# EAGLE design Gateway v1 (EAGLE 9.5.0)
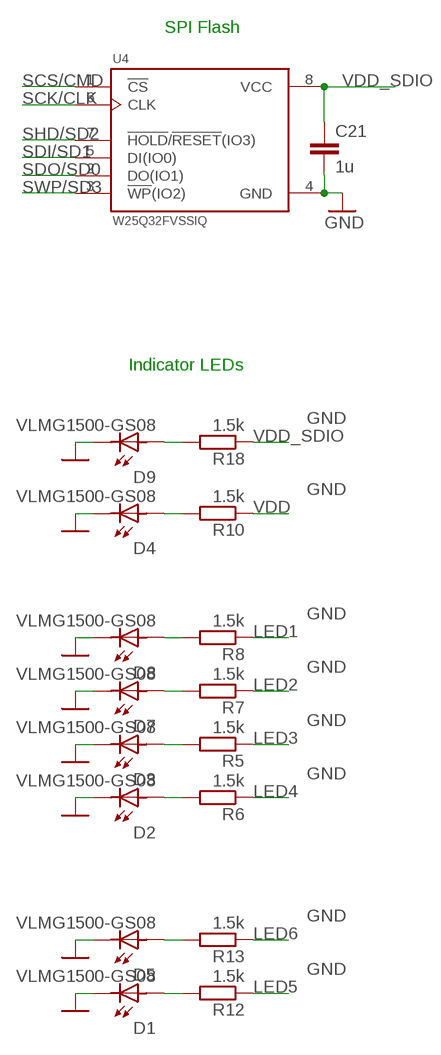
[diagram p0: schematic, sheet 1, part 1 of 2]
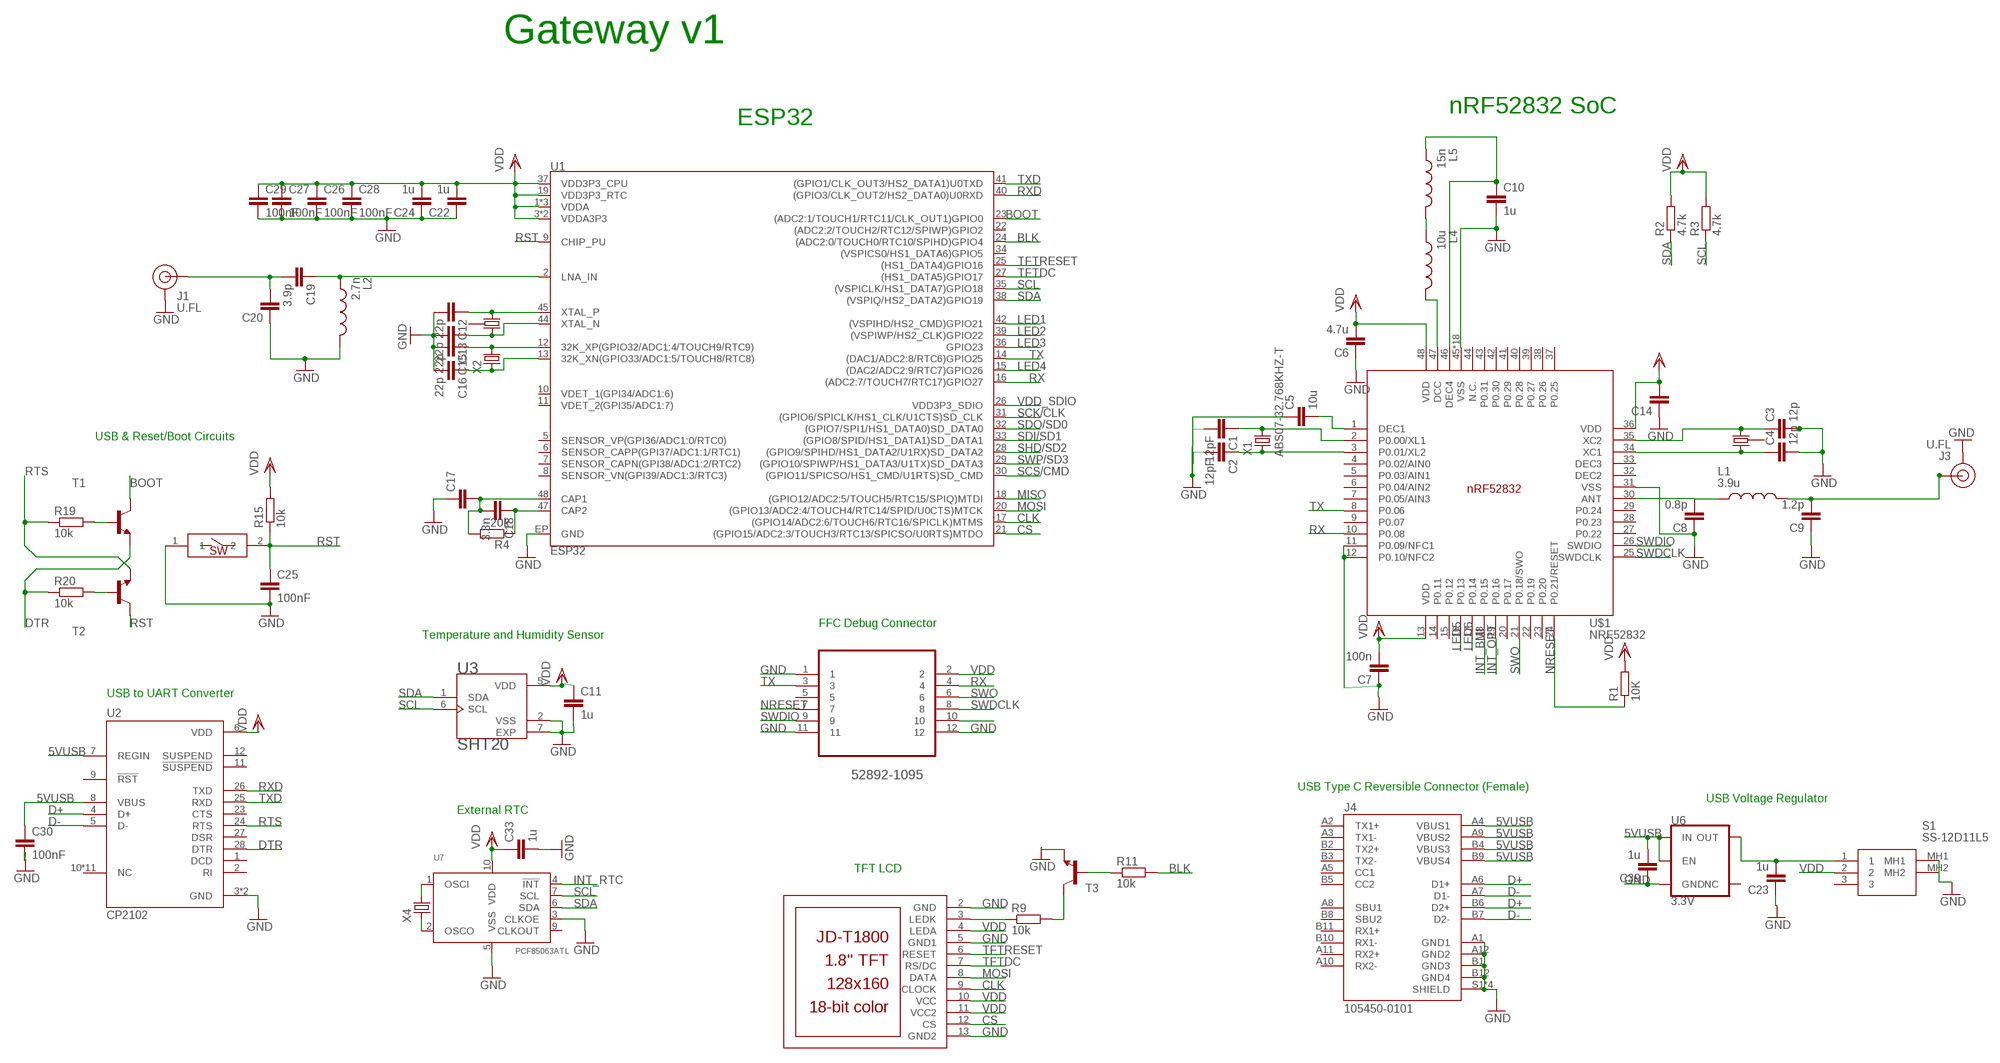
[diagram p1: schematic, sheet 1, part 2 of 2]

## Parts
C1  12pF  CC0402  [C0402]
C2  12pF  CC0402  [C0402]
C3  12p  CC0402  [C0402]
C4  12p  CC0402  [C0402]
C5  10u  CC0402  [C0402]
C6  4.7u  CC0402  [C0402]
C7  100n  CC0402  [C0402]
C8  0.8p  CC0402  [C0402]
C9  1.2p  CC0402  [C0402]
C10  1u  CC0402  [C0402]
C11  1u  CC0402  [C0402]
C12  22p  CC0402  [C0402]
C13  22p  CC0402  [C0402]
C14  100u  CC0402  [C0402]
C15  22p  CC0402  [C0402]
C16  22p  CC0402  [C0402]
C17  10n  CC0402  [C0402]
C18  3.3n  CC0402  [C0402]
C19  3.9p  CC0402  [C0402]
C20  2.4p  CC0402  [C0402]
C21  1u  CC0402  [C0402]
C22  1u  CC0603R  [C0603R]
C23  1u  CC0603R  [C0603R]
C24  1u  CC0603R  [C0603R]
C25  100nF  CC0402  [C0402]
C26  100nF  CC0402  [C0402]
C27  100nF  CC0402  [C0402]
C28  100nF  CC0402  [C0402]
C29  100nF  CC0402  [C0402]
C30  100nF  CC0402  [C0402]
C33  1u  CC0603R  [C0603R]
C39  1u  CC0603R  [C0603R]
D1  VLMG1500-GS08  [LEDC1005X35N]
D2  VLMG1500-GS08  [LEDC1005X35N]
D3  VLMG1500-GS08  [LEDC1005X35N]
D4  VLMG1500-GS08  [LEDC1005X35N]
D5  VLMG1500-GS08  [LEDC1005X35N]
D7  VLMG1500-GS08  [LEDC1005X35N]
D8  VLMG1500-GS08  [LEDC1005X35N]
D9  VLMG1500-GS08  [LEDC1005X35N]
J1  U.FL  U.FL2PIN  [U.FL]
J3  U.FL  U.FL2PIN  [U.FL]
J4  105450-0101  [MOLEX_105450-0101]
L1  3.9u  MHQ0402P7N5JT000  [INDC0402X26N]
L2  2.7n  MHQ0402P7N5JT000  [INDC0402X26N]
L4  10u  MHQ0402P7N5JT000  [INDC0402X26N]
L5  15n  MHQ0402P7N5JT000  [INDC0402X26N]
R1  10K  RR0402  [R0402]
R2  4.7k  RR0402  [R0402]
R3  4.7k  RR0402  [R0402]
R4  20k  RR0402  [R0402]
R5  1.5k  RR0402  [R0402]
R6  1.5k  RR0402  [R0402]
R7  1.5k  RR0402  [R0402]
R8  1.5k  RR0402  [R0402]
R9  10k  RR0402  [R0402]
R10  1.5k  RR0402  [R0402]
R11  10k  RR0402  [R0402]
R12  1.5k  RR0402  [R0402]
R13  1.5k  RR0402  [R0402]
R15  10k  RR0402  [R0402]
R18  1.5k  RR0402  [R0402]
R19  10k  RR0402  [R0402]
R20  10k  RR0402  [R0402]
RESET  SMDSWITCH  [RESC4217X170]
S1  SS-12D11L5  [SS12D11L5]
T1  -NPN-SOT23-BEC  [SOT23-BEC]
T2  -NPN-SOT23-BEC  [SOT23-BEC]
T3  -NPN-SOT23-BEC  [SOT23-BEC]
U1  ESP32  [QFN48-0.4MM]
U2  CP2102  [QFN50P500X500X100-29N]
U3  SHT20  [DFN300X300X110-7N]
U4  W25Q32FVSSIQ  [SOIC127P790X216-8N]
U5  52892-1095  [MOLEX_52892-1095]
U6  3.3V  V_REG_AP2112K-3.3V  [SOT23-5]
U7  PCF85063ATL  [SOT1197-1]
U$1  NRF52832  [QFN40P600X600X90-48_N]
U$2  ADAFRUIT_JD-T1800  [ADAFRUIT_JD-T1800]
X1  ABS07-32.768KHZ-T  [ABS07-32.768KHZ-T]
X2  ABS07-32.768KHZ-T  [ABS07-32.768KHZ-T]
X4  ABS07-32.768KHZ-T  [ABS07-32.768KHZ-T]
Y1  CRYSTAL-26MHZSMD-3.2X2.5  [CRYSTAL-SMD-3.2X2.5MM]
Y2  CRYSTAL-26MHZSMD-3.2X2.5  [CRYSTAL-SMD-3.2X2.5MM]

## Nets
5VUSB: C30.1 C39.2 J4.A4(VBUS1) J4.A9(VBUS2) J4.B4(VBUS3) J4.B9(VBUS4) U2.7(REGIN) U2.8(VBUS) U6.1(IN) U6.3(EN)
BLK: R11.2 U1.24((ADC2:0/TOUCH0/RTC10/SPIHD)GPIO4)
BOOT: T1.C U1.23((ADC2:1/TOUCH1/RTC11/CLK_OUT1)GPIO0)
CLK: U1.17((GPIO14/ADC2:6/TOUCH6/RTC16/SPICLK)MTMS) U$2.9(CLOCK)
CS: U1.21((GPIO15/ADC2:3/TOUCH3/RTC13/SPICSO/U0RTS)MTDO) U$2.12(CS)
D+: J4.A6(D1+) J4.B6(D2+) U2.4(D+)
D-: J4.A7(D1-) J4.B7(D2-) U2.5(D-)
DTR: R20.1 T1.E U2.28(DTR)
GND: C1.2 C2.2 C3.2 C4.2 C5.1 C6.1 C7.1 C8.1 C9.1 C10.2 C11.2 C12.2 C13.2 C14.1 C15.2 C16.2 C17.1 C20.1 C21.2 C22.1 C23.1 C24.1 C25.2 C26.2 C27.2 C28.2 C29.2 C30.2 C33.2 C39.1 D1.2 D2.2 D3.2 D4.2 D5.2 D7.2 D8.2 D9.2 J1.1(GND) J1.2(GND) J3.1(GND) J3.2(GND) J4.A1(GND1) J4.A12(GND2) J4.B1(GND3) J4.B12(GND4) J4.S1(SHIELD) J4.S2(SHIELD) J4.S3(SHIELD) J4.S4(SHIELD) L2.2 RESET.1 S1.MH1 S1.MH2 T3.E U1.EP(GND) U2.3(GND) U2.29(GND) U3.2(VSS) U3.7(EXP) U4.4(GND) U5.1 U5.11 U5.12 U6.2(GND) U7.3(CLKOE) U7.5(VSS) U$1.11(P0.09/NFC1) U$1.12(P0.10/NFC2) U$1.31(VSS) U$1.45(VSS) U$1.PAD(VSS) U$1.PAD@VIA01(VSS) U$1.PAD@VIA02(VSS) U$1.PAD@VIA03(VSS) U$1.PAD@VIA04(VSS) U$1.PAD@VIA05(VSS) U$1.PAD@VIA06(VSS) U$1.PAD@VIA07(VSS) U$1.PAD@VIA08(VSS) U$1.PAD@VIA09(VSS) U$1.PAD@VIA10(VSS) U$1.PAD@VIA11(VSS) U$1.PAD@VIA12(VSS) U$1.PAD@VIA13(VSS) U$1.PAD@VIA14(VSS) U$1.PAD@VIA15(VSS) U$1.PAD@VIA16(VSS) U$2.2(GND) U$2.5(GND1) U$2.13(GND2)
INT_BMI: U$1.18(P0.15)
INT_OPT: U$1.19(P0.16)
INT_RTC: U7.4(!INT!)
LED1: R8.1 U1.42((VSPIHD/HS2_CMD)GPIO21)
LED2: R7.1 U1.39((VSPIWP/HS2_CLK)GPIO22)
LED3: R5.1 U1.36(GPIO23)
LED4: R6.1 U1.15((DAC2/ADC2:9/RTC7)GPIO26)
LED5: R12.1 U$1.16(P0.13)
LED6: R13.1 U$1.17(P0.14)
MISO: U1.18((GPIO12/ADC2:5/TOUCH5/RTC15/SPIQ)MTDI)
MOSI: U1.20((GPIO13/ADC2:4/TOUCH4/RTC14/SPID/U0CTS)MTCK) U$2.8(DATA)
N$1: C1.1 U$1.2(P0.00/XL1) X1.2
N$2: C2.1 U$1.3(P0.01/XL2) X1.1
N$3: C3.1 U$1.35(XC2) Y1.3
N$4: C4.1 U$1.34(XC1) Y1.1
N$5: C5.2 U$1.1(DEC1)
N$6: C8.2 L1.1 U$1.30(ANT)
N$7: C13.1 U1.44(XTAL_N) Y2.3
N$8: C12.1 U1.45(XTAL_P) Y2.1
N$9: L4.2 U$1.47(DCC)
N$10: L4.1 L5.2
N$11: C10.1 L5.1 U$1.46(DEC4)
N$12: C15.1 U1.12(32K_XP(GPIO32/ADC1:4/TOUCH9/RTC9)) X2.2
N$13: C16.1 U1.13(32K_XN(GPIO33/ADC1:5/TOUCH8/RTC8)) X2.1
N$14: C18.1 R4.1 U1.47(CAP2)
N$15: R19.2 T1.B
N$16: C17.2 C18.2 R4.2 U1.48(CAP1)
N$17: R20.2 T2.B
N$18: D3.1 R5.2
N$19: D7.1 R7.2
N$20: D8.1 R8.2
N$21: U5.10
N$22: C19.1 L2.1 U1.2(LNA_IN)
N$24: D2.1 R6.2
N$25: D4.1 R10.2
N$26: D1.1 R12.2
N$27: D5.1 R13.2
N$28: C19.2 C20.2 J1.FEED(SIGNAL)
N$29: R9.1 U$2.3(LEDK)
N$30: C23.2 S1.1 U6.5(OUT)
N$31: D9.1 R18.2
N$33: U7.1(OSCI) X4.2
N$34: U7.2(OSCO) X4.1
N$44: R11.1 T3.B
N$45: R9.2 T3.C
NRESET: R1.1 U5.7 U$1.24(P0.21/RESET)
RFP1: C9.2 J3.FEED(SIGNAL) L1.2
RST: C25.1 R15.1 RESET.2 T2.C U1.9(CHIP_PU)
RTS: R19.1 T2.E U2.24(RTS)
RX: U1.16((ADC2:7/TOUCH7/RTC17)GPIO27) U5.4 U$1.10(P0.08)
RXD: U1.40((GPIO3/CLK_OUT2/HS2_DATA0)U0RXD) U2.26(TXD)
SCK/CLK: U1.31((GPIO6/SPICLK/HS1_CLK/U1CTS)SD_CLK) U4.6(CLK)
SCL: R3.1 U1.35((VSPICLK/HS1_DATA7)GPIO18) U3.6(SCL) U7.7(SCL)
SCS/CMD: U1.30((GPIO11/SPICSO/HS1_CMD/U1RTS)SD_CMD) U4.1(!CS)
SDA: R2.1 U1.38((VSPIQ/HS2_DATA2)GPIO19) U3.1(SDA) U7.6(SDA)
SDI/SD1: U1.33((GPIO8/SPID/HS1_DATA1)SD_DATA1) U4.5(DI(IO0))
SDO/SD0: U1.32((GPIO7/SPI1/HS1_DATA0)SD_DATA0) U4.2(DO(IO1))
SHD/SD2: U1.28((GPIO9/SPIHD/HS1_DATA2/U1RX)SD_DATA2) U4.7(!HOLD!/!RESET!(IO3))
SWDCLK: U5.8 U$1.25(SWDCLK)
SWDIO: U5.9 U$1.26(SWDIO)
SWO: U5.6 U$1.21(P0.18/SWO)
SWP/SD3: U1.29((GPIO10/SPIWP/HS1_DATA3/U1TX)SD_DATA3) U4.3(!WP!(IO2))
TFTDC: U1.27((HS1_DATA5)GPIO17) U$2.7(RS/DC)
TFTRESET: U1.25((HS1_DATA4)GPIO16) U$2.6(RESET)
TX: U1.14((DAC1/ADC2:8/RTC6)GPIO25) U5.3 U$1.8(P0.06)
TXD: U1.41((GPIO1/CLK_OUT3/HS2_DATA1)U0TXD) U2.25(RXD)
VDD: C6.2 C7.2 C11.1 C14.2 C22.2 C24.2 C26.1 C27.1 C28.1 C29.1 C33.1 R1.2 R2.2 R3.2 R10.1 R15.2 S1.2 U1.1(VDDA) U1.3(VDDA3P3) U1.4(VDDA3P3) U1.19(VDD3P3_RTC) U1.37(VDD3P3_CPU) U1.43(VDDA) U1.46(VDDA) U2.6(VDD) U3.5(VDD) U5.2 U7.10(VDD) U$1.13(VDD) U$1.36(VDD) U$1.48(VDD) U$2.4(LEDA) U$2.10(VCC) U$2.11(VCC2)
VDD_SDIO: C21.1 R18.1 U1.26(VDD3P3_SDIO) U4.8(VCC)
Unconnected: J4.A2(TX1+) J4.A3(TX1-) J4.A5(CC1) J4.A8(SBU1) J4.A10(RX2-) J4.A11(RX2+) J4.B2(TX2+) J4.B3(TX2-) J4.B5(CC2) J4.B8(SBU2) J4.B10(RX1-) J4.B11(RX1+) S1.3 U1.5(SENSOR_VP(GPI36/ADC1:0/RTC0)) U1.6(SENSOR_CAPP(GPI37/ADC1:1/RTC1)) U1.7(SENSOR_CAPN(GPI38/ADC1:2/RTC2)) U1.8(SENSOR_VN(GPI39/ADC1:3/RTC3)) U1.10(VDET_1(GPI34/ADC1:6)) U1.11(VDET_2(GPI35/ADC1:7)) U1.22((ADC2:2/TOUCH2/RTC12/SPIWP)GPIO2) U1.34((VSPICS0/HS1_DATA6)GPIO5) U2.1(DCD) U2.2(RI) U2.9(!RST) U2.10(NC) U2.11(!SUSPEND) U2.12(SUSPEND) U2.13(NC) U2.14(NC) U2.15(NC) U2.16(NC) U2.17(NC) U2.18(NC) U2.19(NC) U2.20(NC) U2.21(NC) U2.22(NC) U2.23(CTS) U2.27(DSR) U5.5 U6.4(NC) U7.9(CLKOUT) U$1.4(P0.02/AIN0) U$1.5(P0.03/AIN1) U$1.6(P0.04/AIN2) U$1.7(P0.05/AIN3) U$1.9(P0.07) U$1.14(P0.11) U$1.15(P0.12) U$1.20(P0.17) U$1.22(P0.19) U$1.23(P0.20) U$1.27(P0.22) U$1.28(P0.23) U$1.29(P0.24) U$1.32(DEC2) U$1.33(DEC3) U$1.37(P0.25) U$1.38(P0.26) U$1.39(P0.27) U$1.40(P0.28) U$1.41(P0.29) U$1.42(P0.30) U$1.43(P0.31) U$1.44(N.C.) Y1.2 Y1.4 Y2.2 Y2.4

## Notes on the sheet
- Gateway v1
- nRF52832 SoC
- ESP32
- SPI Flash
- Indicator LEDs
- USB & Reset/Boot Circuits
- FFC Debug Connector
- Temperature and Humidity Sensor
- USB to UART Converter
- USB Type C Reversible Connector (Female)
- USB Voltage Regulator
- External RTC
- TFT LCD

## Library data of the parts
C1-C21 C25-C30 = eagle-ltspice:C: CAPACITOR, European symbol; SPICEMODEL: NONE; SPICEPREFIX: C
C22-C24 C33 C39 = eagle-ltspice:C: CAPACITOR, European symbol
D1-D5 D7-D9 = VLMG1500-GS08:VLMG1500-GS08: 0402 GREEN 571nm 35MCD 65° Rectangle with Flat Top SMT LED; AVAILABILITY: Unavailable; DESCRIPTION: 0402 GREEN 571nm 35MCD 65° Rectangle with Flat Top SMT LED; MF: Vishay; MP: VLMG1500-GS08; PACKAGE: 0402 Vishay; PRICE: None
J1 J3 = SparkFun-Connectors:U.FL2PIN: SMD Antenna Connector - U.FL 2mm height, 3.0mm x 3.0mm receptacle size. SparkFun Products: SparkFun WiFi Shield - ESP8266 <https://www.sparkfun.com/products/13287> SparkFun ESP8266 Thing <https://www.sparkfun.com/products/13231> SparkFun MiniGen - Pro Mini Signal Generator Shield <https://www.sparkfun.com/products/11420>; PROD_ID: CONN-09193; SF_ID: WRL-09144
J4 = 105450-0101:105450-0101: USB Shielded I/O Receptacle; Type C; Right Angle; Surface Mount; Gold over Nickel; AVAILABILITY: Unavailable; DESCRIPTION: USB-C (USB TYPE-C) USB 3.1 (USB 3.1 Gen 2, Superspeed+) Receptacle Connector 24 Position Surface Mount, Right Angle; Through Hole; MF: Molex; MP: 1054500101; PACKAGE: None; PRICE: None
L1 L2 L4 L5 = MHQ0402P7N5JT000:MHQ0402P7N5JT000: 221 NH 5% GOLD TERMINAL; AVAILABILITY: Unavailable; DESCRIPTION: FIXED IND 7.5NH 200MA 1.2 OHM; MF: TDK; MP: MHQ0402P7N5JT000; PACKAGE: 0402 TDK; PRICE: None
R1-R13 R15 R18-R20 = eagle-ltspice:R: RESISTOR, European symbol; SPICEMODEL: NONE; SPICEPREFIX: R
RESET = SMD SWITCH:SMDSWITCH
S1 = SS-12D11L5:SS-12D11L5: Toggle Switches DIP RoHS Source: Datasheet <https://datasheet.lcsc.com/szlcsc/XKB-SS-12D11L5_C319010.pdf>; ARROW_PART_NUMBER: SS-12D11L5; DESCRIPTION: Toggle Switches DIP RoHS; HEIGHT: 6.9mm; MANUFACTURER_NAME: XKB Enterprise; MANUFACTURER_PART_NUMBER: SS-12D11L5
T1-T3 = DC_LOAD_AU:*-NPN-: NPN Transistror BF959 corrected 2008.03.06
U1 = SparkFun-RF:ESP32: Espressif ESP32 WiFi-compatible SoC microcontroller. Bluetooth Low energy support (BLE, BT4.0, Bluetooth Smart) 28 GPIO pins Dual-core Tensilica LX6 microprocessor Hardware accelerated encryption (AES, SHA2, ECC, RSA-4096) 4MB Flash memory 520kB internal SRAM Datasheet <https://cdn.sparkfun.com/datasheets/IoT/esp32_datasheet_en.pdf> SparkFun Products: SparkFun ESP32 Thing <https://www.sparkfun.com/products/13907>; PROD_ID: IC-13338
U2 = CP2102:CP2102: USB to UART Bridge; AVAILABILITY: Unavailable; DESCRIPTION: USB Bridge, USB to UART USB 2.0 UART Interface 28-QFN _5x5_; MF: Silicon Labs; MP: CP2102; PACKAGE: WFQFN-20 Silicon Labs; PRICE: None
U3 = SHT20:SHT20: SHT20 3.6 V -40 to +125°C Fully Calibrated Digital Humidity & Temperature Sensor; AVAILABILITY: Unavailable; DESCRIPTION: SHT20 3.6 V -40 to +125°C Fully Calibrated Digital Humidity & Temperature Sensor; MF: Sensirion AG; MP: SHT20; PACKAGE: DFN-6 Sensirion; PRICE: None
U4 = W25Q32FVSSIQ:W25Q32FVSSIQ: NOR Flash Serial-SPI 3V/3.3V 32M-bit 4M x 8 8.5ns 8-Pin SOIC; AVAILABILITY: Unavailable; DESCRIPTION: Flash Serial-SPI 3V 32Mbit 32M x 1bit 7ns 8-Pin SOIC Bulk; MF: Winbond Electronics; MP: W25Q32FVSSIQ; PACKAGE: SOIC-8 Winbond; PRICE: None
U5 = 52892-1095:52892-1095: CONNECTOR, FPC, ZIF, 0.50MM, 10 WAY; AVAILABILITY: Unavailable; DESCRIPTION: Socket, r/a, Fpc, Zif, Smt, 10way; MF: Molex; MP: 52892-1095; PACKAGE: None; PRICE: None
U6 = SparkFun-IC-Power:V_REG_AP2112: AP2112 - 600mA CMOS LDO Regulator w/ Enable The AP2112 is CMOS process low dropout linear regulator with enable function, the regulator delivers a guaranteed 600mA (min.) continuous load current. Features Output Voltage Accuracy: ±1.5% Output Current: 600mA (Min.) Foldback Short Current Protection: 50mA Enable Function to Turn ON/OFF VOUT Low Dropout Voltage (3.3V): 250mV (Typ.) @IOUT=600mA Excellent Load Regulation: 0.2%/A (Typ.) Excellent Line Regulation: 0.02%/V (Typ.) Low Quiescent Current: 55μA (Typ.) Low Standby Current: 0.01μA (Typ.) Low Output Noise: 50μVRMS PSRR: 100Hz -65dB, 1kHz -65dB OTSD Protection Stable with 1.0μF Flexible Cap: Ceramic, Tantalum and Aluminum Electrolytic Operation Temperature Range: -40°C to 85°C ESD: MM 400V, HBM 4000V; PROD_ID: VREG-12457
U7 = PCF85063ATL:PCF85063ATL: Tiny Real-Time Clock/calendar with alarm function and I2C-bus The PCF85063A is a CMOS1 Real-Time Clock (RTC) and calendar optimized for low power consumption. An offset register allows fine-tuning of the clock. All addresses and data are transferred serially via the two-line bidirectional I2C-bus. Maximum data rate is 400 kbit/s. The register address is incremented automatically after each written or read data byte. AAL Eindhoven MK; AVAILABILITY: Unavailable; DESCRIPTION: Real Time Clock _RTC_ IC Clock/Calendar I²C, 2-Wire Serial 10-XFDFN Exposed Pad; MF: NXP USA; MP: PCF85063ATL; PACKAGE: DFN-10 NXP Semiconductors; PRICE: None
U$1 = Nordic_nRF:NRF52832: nRF52832 Features Single chip, highly flexible, 2.4 GHz multi-protocol SoC 32-bit ARM Cortex-M4F Processor 1.7v to 3.6v operation 512kB flash + 64kB RAM Supports concurrent Bluetooth Smart/ANT protocol operation On-chip NFC tag for Out-of-Band (OOB) pairing Up to +4dBm output power -96dBm sensitivity, Bluetooth Smart Thread safe and run-time protected Event driven API On air compatible with nRF24L and nRF24AP series 2 data rates (2Mbps/1Mbps) PPI - maximum flexibility for power-efficient applications and code simplification Automated power management system with automatic power management of each peripheral Configurable I/O mapping for analog and digital I/O 3 x Master/Slave SPI 2 x Two-wire interface (I²C) UART (RTS/CTS) 3 x PWM AES HW encryption Real Time Counter (RTC) Digital microphone interface (PDM) On-chip balun Applications Internet of Things (IoT) Wearables SmartHome sensors Connected white goods Computer peripherals Voice-command smart remotes A4WP ‘Rezence’ wireless charging Beacons Sports and fitness sensors and hubs Connected health products Smart watches RC Toys Interactive games Building automation and sensor networks
U$2 = nRF52 Router (IP) v3:ADAFRUIT_JD-T1800
X1 X2 X4 = Crystals:ABS07-32.768KHZ-T: CRYSTAL 32.7680KHZ 12.5PF SMD Manufacturer's datasheet <https://abracon.com/Resonators/ABS07.pdf>; CREATED_BY: PCBLayout.com; DIGIKEY_PART_NUMBER: 535-9542-2-ND; MANUFACTURER: Abracon LLC; MPN: ABS07-32.768KHZ-T; PACKAGE: SMD-2
Y1 Y2 = SparkFun-Clocks:CRYSTAL-26MHZ: 26MHz Crystal w/ Ground Pin Digikey Example <http://www.digikey.com/product-detail/en/epson/TSX-3225%2026.0000MF09Z-AC3/SER3627CT-ND/1802878> Frequency: 26MHz Frequency Stability: ±9ppm Frequency Tolerance: ±10ppm Load Capacitance: 9pF SparkFun Products: SparkFun ESP32 Thing <https://www.sparkfun.com/products/13907> SparkFun ESP8266 Thing Dev Board <https://www.sparkfun.com/products/13711>; PROD_ID: XTAL-12454

## Net classes
1 PWRINFL: width 0.381 mm, drill 0.305 mm, clearance 0.127 mm

## Board
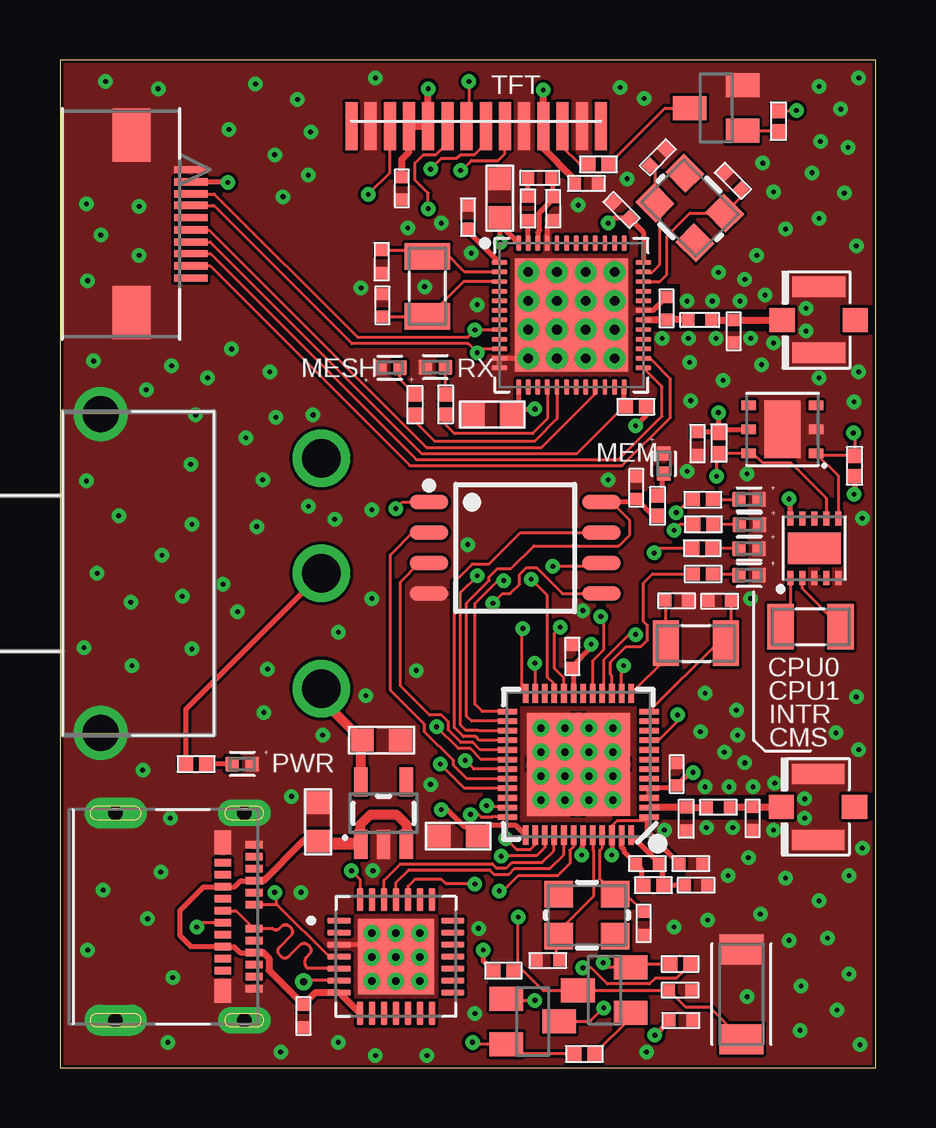
[diagram p2: board, top side]
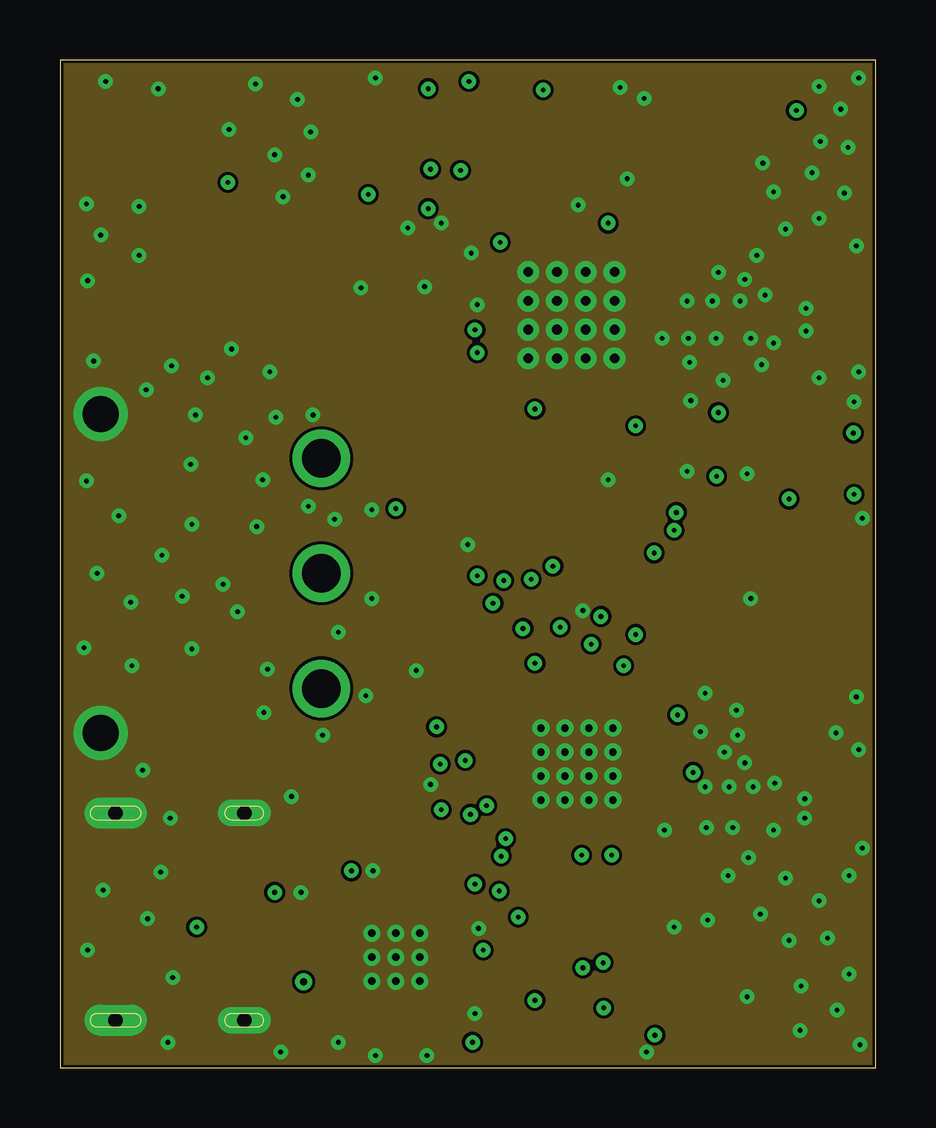
[diagram p3: board, inner layer Route2]
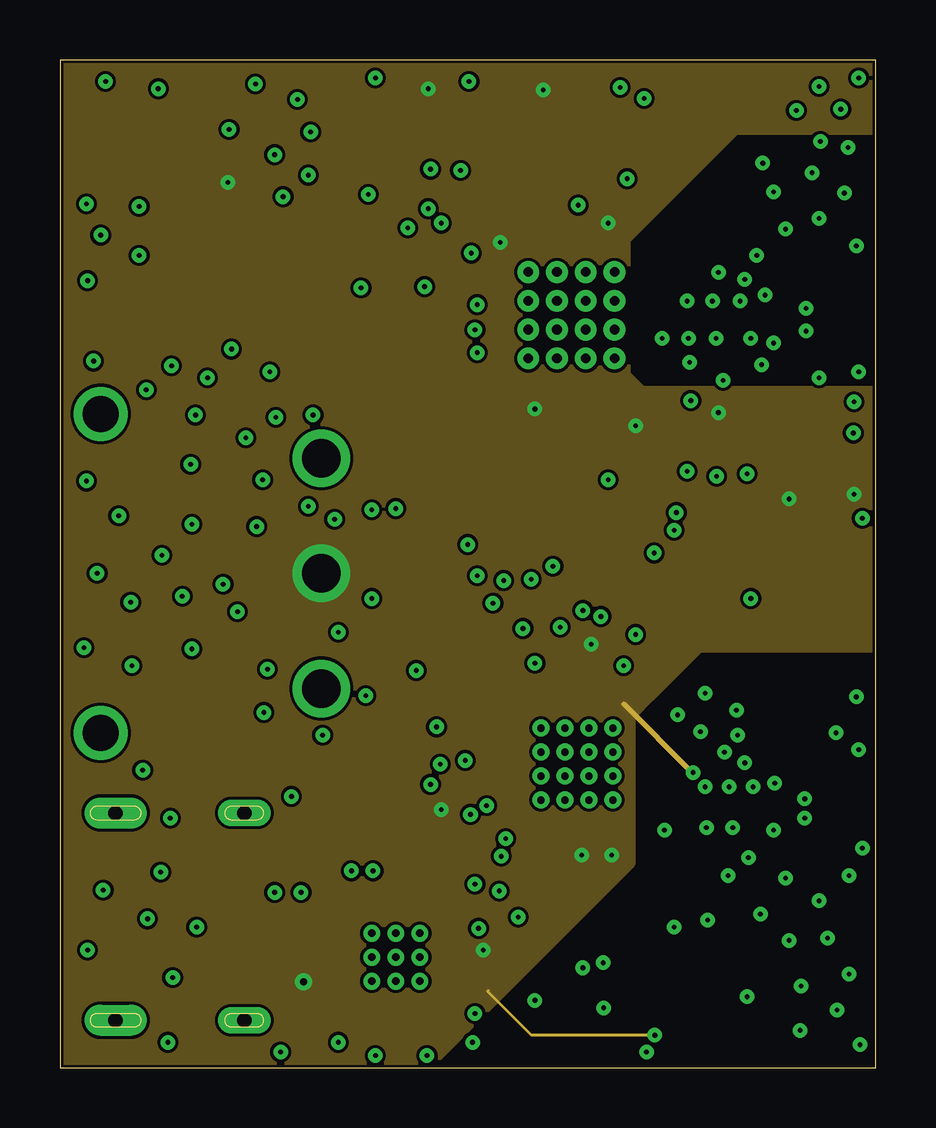
[diagram p4: board, inner layer Route15]
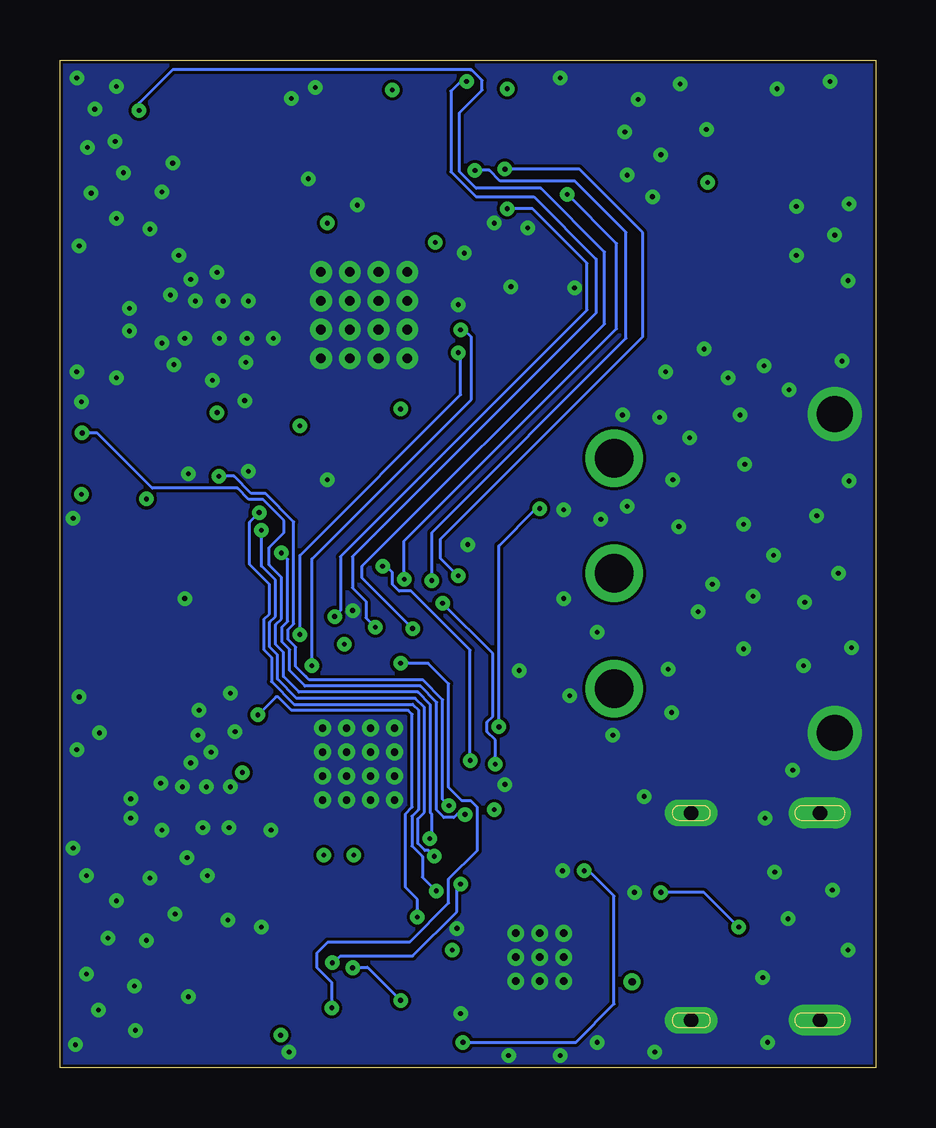
[diagram p5: board, bottom side, seen from below]

Size 34 x 42 mm. Coordinates in mm from the lower left corner, seen from the top.
Outline: 0,0 34,0 34,42 0,42 0,0
Copper layers (1+2*15+16): Top 0.035mm / dielectric 1.5mm / Route2 0.035mm / dielectric 0.15mm / Route15 0.035mm / dielectric 0.2mm / Bottom 0.035mm
Design rules "default *": minimum track width 5mil, minimum drill 0.2mm, track to track 5mil, track to pad 5mil, pad to pad 5mil, via to via 5mil, smd to smd 5mil, copper to edge 5mil, drill to drill 6mil, minimum pad ring 10mil, minimum via ring 8mil, stop-mask expansion 0mil, vias tented up to drill 40mil, thermal gap 0mil
tRestrict: area 24.6,30.7 to 29.6,31.6; area 24.9,10.3 to 29.9,11.3; area 24.7,30.7 to 25.9,32.6

### Footprints (pad centres in the part's own frame; a part is rotated, then mirrored left to right if it is on the bottom)
C0402 = smd 0.5 x 0.5: 1 -0.475,0; 2 0.475,0
C0603R = smd 0.95 x 0.95: 1 -0.85,0; 2 0.75,0
LEDC1005X35N = smd 0.59 x 0.61: 1 -0.415,0; 2 0.415,0
U.FL = smd 2.2 x 0.85: 1 0,1.375; 2 0,-1.375 | smd 1.05 x 1: FEED 1.525,0; NC -1.525,0
MOLEX_105450-0101 = smd 0.3 x 0.7: A1 -3,3.77; A2 -2.5,3.77; A3 -2,3.77; A4 -1.5,3.77; A5 -1,3.77; A6 -0.5,3.77; A7 0.5,3.77; A8 1,3.77; A9 1.5,3.77; A10 2,3.77; A11 2.5,3.77; A12 3,3.77; B2 2.25,2.47; B3 1.75,2.47; B4 1.25,2.47; B5 0.75,2.47; B6 0.25,2.47; B7 -0.25,2.47; B8 -0.75,2.47; B9 -1.25,2.47; B10 -1.75,2.47; B11 -2.25,2.47 | smd 1 x 0.7: B1 3.1,2.47; B12 -3.1,2.47 | drill 0.6 pad 1.1 long: S1 -4.32,3.36; S2 4.32,3.36 | drill 0.6 pad 1.3 long: S3 -4.32,-2; S4 4.32,-2
INDC0402X26N = smd 0.5 x 0.5: 1 -0.732,0; 2 0.232,0
R0402 = smd 0.6 x 0.55: 1 -0.425,0; 2 0.425,0
RESC4217X170 = smd 1.254 x 1.829: 1 -1.875,0; 2 1.875,0
SS12D11L5 = drill 1.6 pad 2.4: 1 0,0; 2 4.8,0; 3 9.6,0 | drill 1.5 pad 2.25: MH1 -1.85,9.2; MH2 11.45,9.2
SOT23-BEC = smd 1 x 1.4: B -0.95,-1.1; C 0,1.1; E 0.95,-1.1
QFN48-0.4MM = smd 0.8 x 0.23: 1 -2.95,2.2; 2 -2.95,1.8; 3 -2.95,1.4; 4 -2.95,1; 5 -2.95,0.6; 6 -2.95,0.2; 7 -2.95,-0.2; 8 -2.95,-0.6; 9 -2.95,-1; 10 -2.95,-1.4; 11 -2.95,-1.8; 12 -2.95,-2.2; 25 2.95,-2.2; 26 2.95,-1.8; 27 2.95,-1.4; 28 2.95,-1; 29 2.95,-0.6; 30 2.95,-0.2; 31 2.95,0.2; 32 2.95,0.6; 33 2.95,1; 34 2.95,1.4; 35 2.95,1.8; 36 2.95,2.2 | smd 0.23 x 0.8: 13 -2.2,-2.95; 14 -1.8,-2.95; 15 -1.4,-2.95; 16 -1,-2.95; 17 -0.6,-2.95; 18 -0.2,-2.95; 19 0.2,-2.95; 20 0.6,-2.95; 21 1,-2.95; 22 1.4,-2.95; 23 1.8,-2.95; 24 2.2,-2.95; 37 2.2,2.95; 38 1.8,2.95; 39 1.4,2.95; 40 1,2.95; 41 0.6,2.95; 42 0.2,2.95; 43 -0.2,2.95; 44 -0.6,2.95; 45 -1,2.95; 46 -1.4,2.95; 47 -1.8,2.95; 48 -2.2,2.95 | smd 4.3 x 4.3: EP 0,0
QFN50P500X500X100-29N = smd 0.97 x 0.26: 1 -2.37,1.5; 2 -2.37,1; 3 -2.37,0.5; 4 -2.37,0; 5 -2.37,-0.5; 6 -2.37,-1; 7 -2.37,-1.5; 15 2.37,-1.5; 16 2.37,-1; 17 2.37,-0.5; 18 2.37,0; 19 2.37,0.5; 20 2.37,1; 21 2.37,1.5 | smd 0.26 x 0.97: 8 -1.5,-2.37; 9 -1,-2.37; 10 -0.5,-2.37; 11 0,-2.37; 12 0.5,-2.37; 13 1,-2.37; 14 1.5,-2.37; 22 1.5,2.37; 23 1,2.37; 24 0.5,2.37; 25 0,2.37; 26 -0.5,2.37; 27 -1,2.37; 28 -1.5,2.37 | smd 3.15 x 3.15: 29 0,0
DFN300X300X110-7N = smd 0.6 x 0.4: 1 -1.4,1; 2 -1.4,0; 3 -1.4,-1; 4 1.4,-1; 5 1.4,0; 6 1.4,1 | smd 1.5 x 2.4: 7 0,0
SOIC127P790X216-8N = smd 1.6 x 0.6: 1 -3.6,1.905; 2 -3.6,0.635; 3 -3.6,-0.635; 4 -3.6,-1.905; 5 3.6,-1.905; 6 3.6,-0.635; 7 3.6,0.635; 8 3.6,1.905
MOLEX_52892-1095 = smd 0.305 x 1.397: 1 2.261,2.896; 2 1.753,2.896; 3 1.245,2.896; 4 0.762,2.896; 5 0.254,2.896; 6 -0.254,2.896; 7 -0.762,2.896; 8 -1.245,2.896; 9 -1.753,2.896; 10 -2.261,2.896 | smd 2.21 x 1.6: 11 -3.702,5.359; 12 3.702,5.359
SOT23-5 = smd 0.55 x 1.2: 1 -0.95,-1.3; 2 0,-1.3; 3 0.95,-1.3; 4 0.95,1.3; 5 -0.95,1.3
SOT1197-1 = smd 0.25 x 0.575: 1 -1,-1.238; 2 -0.5,-1.238; 3 0,-1.238; 4 0.5,-1.238; 5 1,-1.238; 6 1,1.238; 7 0.5,1.238; 8 0,1.238; 9 -0.5,1.238; 10 -1,1.238 | smd 2.2 x 1.3: CP 0,0
QFN40P600X600X90-48_N = smd 0.65 x 0.2: 1 -3,2.2; 2 -3,1.8; 3 -3,1.4; 4 -3,1; 5 -3,0.6; 6 -3,0.2; 7 -3,-0.2; 8 -3,-0.6; 9 -3,-1; 10 -3,-1.4; 11 -3,-1.8; 12 -3,-2.2; 25 3,-2.2; 26 3,-1.8; 27 3,-1.4; 28 3,-1; 29 3,-0.6; 30 3,-0.2; 31 3,0.2; 32 3,0.6; 33 3,1; 34 3,1.4; 35 3,1.8; 36 3,2.2 | smd 0.2 x 0.65: 13 -2.2,-3; 14 -1.8,-3; 15 -1.4,-3; 16 -1,-3; 17 -0.6,-3; 18 -0.2,-3; 19 0.2,-3; 20 0.6,-3; 21 1,-3; 22 1.4,-3; 23 1.8,-3; 24 2.2,-3; 37 2.2,3; 38 1.8,3; 39 1.4,3; 40 1,3; 41 0.6,3; 42 0.2,3; 43 -0.2,3; 44 -0.6,3; 45 -1,3; 46 -1.4,3; 47 -1.8,3; 48 -2.2,3 | smd 4.7 x 4.7: PAD 0,0 | drill 0.4: PAD@VIA01 -1.8,1.8; PAD@VIA02 -1.8,0.6; PAD@VIA03 -1.8,-0.6; PAD@VIA04 -1.8,-1.8; PAD@VIA05 -0.6,1.8; PAD@VIA06 -0.6,0.6; PAD@VIA07 -0.6,-0.6; PAD@VIA08 -0.6,-1.8; PAD@VIA09 0.6,1.8; PAD@VIA10 0.6,0.6; PAD@VIA11 0.6,-0.6; PAD@VIA12 0.6,-1.8; PAD@VIA13 1.8,1.8; PAD@VIA14 1.8,0.6; PAD@VIA15 1.8,-0.6; PAD@VIA16 1.8,-1.8
ADAFRUIT_JD-T1800 = smd 0.5 x 2: 1 5.2,-0.4; 2 4.4,-0.4; 3 3.6,-0.4; 4 2.8,-0.4; 5 2,-0.4; 6 1.2,-0.4; 7 0.4,-0.4; 8 -0.4,-0.4; 9 -1.2,-0.4; 10 -2,-0.4; 11 -2.8,-0.4; 12 -3.6,-0.4; 13 -4.4,-0.4; 14 -5.2,-0.4
ABS07-32.768KHZ-T = smd 1.1 x 1.9: 1 -1.25,0; 2 1.25,0
CRYSTAL-SMD-3.2X2.5MM = smd 1.2 x 1.1: 1 -1.175,-0.875; 2 1.175,-0.875; 3 1.175,0.875; 4 -1.175,0.875

### Placement (x,y rotation side)
C1  13.41,33.59 270 top
C2  13.44,31.77 90 top
C3  24.92,37.94 45 top
C4  28.06,36.96 135 top
C5  17.01,35.45 270 top
C6  21.36,17.14 270 top
C7  25.71,12.23 270 top
C8  25.29,31.64 270 top
C9  28.09,30.69 90 top
C10  20.56,35.8 270 top
C11  23.41,35.74 135 top
C12  24.34,6 270 top
C13  20.34,4.46 180 top
C14  25.89,1.97 180 top
C15  27.5,19.44 180 top
C16  25.71,19.46 0 top
C17  26.52,7.6 180 top
C18  24.49,8.5 0 top
C19  27.45,10.85 0 top
C20  28.88,10.38 90 top
C21  24.02,24.17 90 top
C22  18.07,27.22 0 top
C23  13.35,13.65 180 top
C24  16.65,9.64 0 top
C25  25.86,3.23 0 top
C26  26.3,8.5 0 top
C27  14.25,36.65 270 top
C28  26.57,26.01 270 top
C29  21.95,36.85 0 top
C30  10.15,2.15 270 top
C33  18.33,36.29 90 top
C39  10.76,10.19 270 top
D1  15.65,29.2 180 top
D2  28.72,20.53 0 top
D3  28.72,21.63 0 top
D4  7.59,12.65 0 top
D5  13.76,29.17 180 top
D7  28.75,22.63 0 top
D8  28.72,23.68 0 top
D9  25.17,25.17 90 top
J1  31.6,10.87 180 top
J3  31.63,31.16 180 top
J4  4.32,6.29 270 top
L1  26.92,31.16 0 top
L2  26.11,10.12 270 top
L4  19.51,35.56 270 top
L5  19.75,37.09 180 top
R1  24.01,27.55 0 top
R2  33.12,25.08 270 top
R3  27.48,26.03 90 top
R4  24.74,7.6 0 top
R5  26.77,21.65 0 top
R6  26.81,20.57 0 top
R7  26.82,22.65 0 top
R8  26.8,23.68 0 top
R9  22.45,37.65 0 top
R10  5.67,12.65 0 top
R11  29.95,39.45 90 top
R12  16.07,27.64 90 top
R13  14.8,27.63 90 top
R15  18.48,4.04 180 top
R18  24.91,23.42 90 top
R19  25.86,4.32 0 top
R20  21.86,0.56 0 top
RESET  28.41,3.06 270 top
S1  10.9,15.8 90 top
T1  19.7,1.92 270 top
T2  22.7,3.23 90 top
T3  27.35,40 90 top
U1  21.61,12.64 180 top
U2  14.01,4.63 0 top
U3  30.11,26.6 180 top
U4  18.98,21.66 0 top
U5  8.35,35.17 90 top
U6  13.49,10.6 0 top
U7  31.45,21.65 0 top
U$1  21.32,31.36 0 top
U$2  17.35,39.65 0 top
X1  15.32,32.56 90 top
X2  26.51,17.68 0 top
X4  31.29,18.38 180 top
Y1  26.26,35.83 135 top
Y2  21.97,6.35 180 top

### Tracks (layer width: path | path; a pad name or v marks a point on that pad's centre or on a via)
5VUSB
  Top 0.2: 10.82,9.44 12.4,9.44 | U6.1 | J4.A4 7.54,7.79 7.29,7.54 J4.B9 5.99,7.54 5,6.55 5,5.5 5.46,5.04 J4.B4 7.26,5.04 7.51,4.79 J4.A9 | 10.09,9.44 10.22,9.44
  Top 0.3: J4.A4 8.48,7.79 10.13,9.44 10.22,9.44 | 10.82,9.44 C39.2 12.4,9.44 U6.1 | 14.44,9.45 U6.3 | J4.A9 8.48,4.79 8.72,4.55 8.72,4.06 C30.1 10.65,3.13 U2.7 U2.8
  Top 0.406: 14.44,9.45 14.44,10.13 14.03,10.55 12.95,10.55 12.54,10.14 U6.1 10.9,9.3 C39.2 10.22,9.44
BLK  (via drill 0.2)
  Top 0.127: U1.24 19.25,15.75 19.25,18.25 v19.3,18.3 | v30.7,39.9 30.68,39.88 R11.2
  Bottom 0.127: v19.3,18.3 21.4,20.4 21.4,20.9 11.3,31 11.3,34 13.95,36.65 16.65,36.65 17.35,37.35 17.35,39.8 16.4,40.75 16.4,41.15 16.85,41.59 16.89,41.59 16.9,41.6 29.3,41.6 30.7,40.2 v30.7,39.9
BOOT  (via drill 0.2)
  Top 0.127: T1.C 22.1,1.92 v22.66,2.49 | v19.8,16.85 v19.81,16.84 U1.23
  Bottom 0.127: v22.66,2.49 22.66,3.54 23.29,4.17 23.29,4.77 22.83,5.24 19.41,5.24 17.79,6.86 17.79,7.85 16.6,9.05 16.6,10.85 16.87,11.12 17.24,11.12 17.79,11.67 17.79,15.99 18.65,16.85 v19.8,16.85
CLK  (via drill 0.2)
  Top 0.127: v15.35,35.8 15.35,36.45 14.8,37 14.8,37.7 15.16,38.06 15.68,38.06 16.15,38.53 U$2.9 | U1.17 22.21,16.96 22.65,17.4 22.65,18.7 v22.55,18.8
  Bottom 0.127: v15.35,35.8 14.3,35.8 12.03,33.52 12.03,31.57 22.31,21.29 22.31,19.04 v22.55,18.8
CS  (via drill 0.2)
  Top 0.127: U1.21 20.61,15.99 20.31,16.29 20.31,19.69 v19.65,20.35 | U$2.12 13.75,37.3 v12.85,36.4
  Bottom 0.127: v19.65,20.35 19.65,21.95 10.8,30.8 10.8,34.35 v12.85,36.4
D+  (via drill 0.2)
  Top 0.127: 9.01,6.79 J4.A6 | J4.B6 5.89,6.04 v5.7,5.85 | v8.95,7.3 9.01,7.24 9.01,6.79 | 9.01,6.79 9.06,6.79 11.24,4.61 11.62,4.61 U2.4
  Bottom 0.127: v5.7,5.85 7.15,7.3 v8.95,7.3
D-
  Top 0.127: J4.B7 7.34,6.54 J4.A7 8.86,5.79 8.85,5.8 arc90 9.16,5.8 9.24,5.89 arc-90 9.56,5.89 9.63,5.82 arc-90 9.63,5.5 9.15,5.02 arc90 9.15,4.7 9.22,4.63 arc90 9.53,4.63 10.02,5.12 arc-90 10.33,5.12 10.41,5.04 arc-90 10.41,4.73 10.32,4.64 arc90 10.32,4.13 U2.5
DTR  (via drill 0.2)
  Top 0.127: R20.1 19.01,0.56 T1.E 17.28,0.97 v17.2,1.05 | v12.15,8.2 12.51,7.84 U2.28
  Bottom 0.127: v17.2,1.05 12.5,1.05 10.9,2.65 10.9,7.15 11.95,8.2 v12.15,8.2
GND  (via drill 0.2, 0.3)
  Top 0.127: 20.49,35.26 C10.2
  Top 0.2: U$1.45 20.32,35.09 20.49,35.26 | C8.1 24.73,31.56 U$1.31 | U2.3 12.53,5.13 v13,5.6 | U$1.12 U$1.11 U$1.PAD@VIA04 U$1.PAD | U$1.PAD 21.89,31.36 21.95,31.3 21.75,31.3 21.69,31.36 U$1.PAD
  other vias: 21.8,19.05 29.75,9.9 31.05,10.4 31.05,11.2 29.8,11.85 28.9,11.7 27.9,11.7 28.05,10 26.95,10 25.2,9.9 26.9,11.7 32,5.4 33.35,0.95 31.65,6.95 30.4,5.3 27.85,8 30.9,3.4 32.4,2.4 30.85,1.55 29.2,6.4 28.65,2.95 32.9,3.9 24.45,0.65 28.7,8.75 2.45,23 25.6,5.85 5.1,19.65 1.55,20.6 2.95,19.4 15.3,0.5 13.15,0.5 9.2,0.65 4.5,1.05 11.6,1.05 4.6,10.4 3,16.75 6.8,20.15 1.1,24.45 5.5,22.65 5.5,17.45 3.45,12.4 1.15,4.9 4.7,3.75 4.2,8.15 1.8,7.4 24.35,40.4 15.9,35.2 23.35,40.85 13.15,41.25 3.65,6.2 8.2,22.55 9.9,40.35 12.55,32.5 17.15,33.95 17.4,31.8 1.7,34.7 6.15,28.75 14.5,35 7.05,39.1 9.3,36.3 4.1,40.8 15.2,32.55 31.65,28.75 29.25,29.3 27.65,28.65 33.1,27.75 28.8,30.4 31.1,30.7 25.1,30.4 26.2,30.4 27.35,30.4 29.4,32.2 13.05,8.2 13,23.25 8.65,16.6 10.35,23.4 4.25,21.35 9,27.1 8.75,29 14.85,16.55 1.1,36 27,6.15 28.25,13.85 1,17.5 23.65,37.05 8.95,38.05 21.6,35.95 8.15,41 10.35,37.2 7.4,19 33.45,9.15 28.8,19.55 10.45,39 8.45,24.5 13,19.55 11.45,22.85 33.2,15.45 7.75,26.25 17,21.8 10.55,27.2 1.4,29.45 3.3,33.85 3.6,28.25 7.15,29.95 5.65,27.2 5.45,25.15 11.6,18.15 10.95,13.85 12.75,15.5 10.05,7.3 9.65,11.3 8.5,14.8 15.45,11.8 3.3,35.9 31.65,40.9 33.3,41.25 32.55,39.95 29.3,37.7 31.7,38.6 1.15,32.8 4.65,29.25 1.9,41.1 30.25,7.9 32.9,8 32.7,36.45 32.85,38.35 33.3,13.25 26.9,15.6 26.7,14 27.7,13.15 28.2,14.9 32.35,13.95 28.55,12.7 27.45,33.15 22.85,24.5 29.75,36.5 29.05,33.85 30.25,34.95 31.35,37.3 33.2,34.25 26.15,31.95 27.2,31.95 31.65,35.4 26.25,29.4 26.3,27.8 33.45,22.9 26.15,24.85 28.65,24.75 33.3,29 29.75,30.2 31.1,31.65 28.35,31.95 28.55,32.85 15,3.6 14,3.6 13,3.6 14,4.6 15,4.6 15,5.6 14,5.6 13,4.6 20.05,11.15 21.05,11.15 22.05,11.15 23.05,11.15 23.05,12.15 22.05,12.15 21.05,12.15 20.05,12.15 20.05,13.15 21.05,13.15 22.05,13.15 23.05,13.15 23.05,14.15 22.05,14.15 21.05,14.15 20.05,14.15 17.45,5.8 17.3,2.25
  pour Top: 0,42 34,42 34,36.2 34,0 0,0
  pour Route2: 0.1,42 34.1,42 34.1,0 0.1,0
  pour Bottom: 0.1,42 34.1,42 34.1,0 0.1,0
LED1  (via drill 0.2)
  Top 0.127: v18.32,7.36 18.39,7.29 19.09,7.99 20.74,7.99 21.26,8.51 21.26,9.05 21.41,9.21 U1.42 | v25.7,23.13 26.24,23.68 R8.1
  Bottom 0.127: v18.32,7.36 18.89,7.94 18.89,8.79 19.33,9.23 19.33,10.48 19.06,10.75 19.06,14.91 19.29,15.14 24.24,15.14 25.19,16.08 25.19,17.1 25.51,17.43 25.51,18.68 25.27,18.91 25.27,20.14 26.09,20.97 26.09,22.73 v25.7,23.13
LED2  (via drill 0.2)
  Top 0.127: U1.39 20.21,9.18 19.85,8.82 18.4,8.82 v18.4,8.81 | v25.6,22.4 25.85,22.65 R7.1
  Bottom 0.127: v18.4,8.81 18.64,9.05 18.79,9.05 19.08,9.34 19.08,10.37 18.81,10.64 18.81,15.02 19.19,15.39 24.14,15.39 24.93,16.19 24.93,17.21 25.26,17.53 25.26,18.57 25.02,18.81 25.02,20.32 25.6,20.9 v25.6,22.4
LED3  (via drill 0.2)
  Top 0.127: v17.11,10.55 17.45,10.55 17.58,10.42 17.99,10.42 18.01,10.44 U1.36 | v24.77,21.45 24.98,21.65 R5.1
  Bottom 0.127: v17.11,10.55 17.45,10.55 17.58,10.42 17.99,10.42 18.3,10.73 18.3,15.22 18.98,15.9 23.79,15.9 24.43,16.54 24.43,17.42 24.75,17.74 24.75,18.36 24.51,18.6 24.51,21.18 v24.77,21.45
LED4
  Top 0.127: U1.15 23.01,16.34 22.96,16.39 22.96,16.9 23.6,17.54 24.22,17.54 24.49,17.82 24.49,18.43 24.32,18.6 24.32,20.2 24.7,20.57 R6.1
LED5
  Top 0.127: U$1.16 20.32,27.05 19.7,26.43 16.45,26.43 16.07,26.8 R12.1
LED6
  Top 0.127: U$1.17 20.72,27.05 19.77,26.1 15.63,26.1 14.8,26.93 R13.1
MOSI  (via drill 0.2)
  Top 0.127: U1.20 21.01,16.25 20.62,16.64 20.62,18.12 v20.85,18.35 | v17.05,41.1 17.05,39.35 U$2.8
  Bottom 0.127: v20.85,18.35 21.24,18.74 21.24,19.43 21.8,20 21.8,21.3 11.65,31.45 11.65,33.7 14.25,36.3 16.66,36.3 17.7,37.34 17.7,40.7 17.3,41.1 v17.05,41.1
N$1
  Top 0.127: U$1.2 16.87,33.16 16.17,33.86 15.37,33.86 X1.2 15.06,34.06 C1.1
N$2
  Top 0.127: U$1.3 16.82,32.76 15.42,31.36 15.37,31.36 X1.1 15.3,31.3 C2.1
N$3
  Top 0.127: U$1.35 24.36,33.12 24.66,33.12 24.98,33.45 24.98,36.02 24.96,36.04 Y1.3 24.81,37.38 C3.1
N$4
  Top 0.127: U$1.34 25.01,32.76 25.3,33.05 25.3,34.65 26.27,35.62 Y1.1 28.4,36.3 C4.1
N$5
  Top 0.2: U$1.1 17.01,34.87 C5.2
N$6
  Top 0.3: U$1.30 C8.2 26.18,31.17 L1.1
N$7
  Top 0.127: 20.7,5.6 20.57,5.47 20.7,5.47 | 20.36,5.6 20.7,5.6 | 20.7,5.47 Y2.3 | U1.44 22.21,9.09 22.24,9.05 22.24,7.14 20.7,5.6 | C13.1 20.7,4.58 20.7,5.47
N$8
  Top 0.127: C12.1 23.59,7.22 Y2.1 22.51,7.86 22.51,9.05 22.61,9.16 U1.45
N$9
  Top 0.127: 19.51,35.2 L4.2
  Top 0.2: U$1.47 19.51,35.2
N$10
  Top 0.127: L5.2
  Top 0.2: L4.1 L5.2
N$11
  Top 0.127: 20.56,36.09 20.56,36.2 C10.1
  Top 0.2: U$1.46 19.92,34.82 19.99,34.89 19.99,35.63 20.56,36.2 | C10.1 20.56,37.01 L5.1
N$12
  Top 0.127: U1.12 27.4,17.68 X2.2 27.98,17.89 C15.1
N$13
  Top 0.127: U1.13 25.26,17.04 X2.1 25.23,17.7 C16.1
N$14
  Top 0.2: R4.1 24.24,7.67 24.24,8.28 C18.1 23.53,8.98 23.53,9.07 23.41,9.19 U1.47
N$15  (via drill 0.2)
  Top 0.127: R19.2 25.69,3.73 24.81,3.73 24.57,3.48 22.82,3.48 22.15,4.16 v21.8,4.16 | v19.8,2.8 18.68,2.8 T1.B
  Bottom 0.127: v21.8,4.16 21.8,4.18 21.18,4.18 v19.8,2.8
N$16
  Top 0.127: U1.48 24.96,8.54 C18.2 24.91,8.45 24.91,8.35 25.16,8.1 R4.2
  Top 0.2: U1.48 24.91,8.59 24.91,8.35 | C18.2 25.09,8.38 25.09,7.67 R4.2 C17.2
N$17
  Top 0.127: R20.2 23.8,2.07 T2.B
N$18
  Top 0.127: R5.2 28.29,21.65 D3.1
N$19
  Top 0.127: R7.2 28.31,22.65 D7.1
N$20
  Top 0.127: R8.2 D8.1
N$22
  Top 0.3: U1.2 26.1,10.84 L2.1 C19.1
N$24
  Top 0.127: R6.2 28.26,20.57 D2.1
N$25
  Top 0.2: D4.1 R10.2
N$26
  Top 0.127: R12.2 D1.1
N$27
  Top 0.127: R13.2 14.17,28.68 D5.1
N$28
  Top 0.3: C19.2 C20.2 J1.FEED
N$29
  Top 0.127: R9.1 21.68,37.65 20.95,38.38 U$2.3
N$30
  Top 0.406: U6.5 12.54,13.59 C23.2 10.9,15.35 S1.1
N$31
  Top 0.2: D9.1 25.09,24.68 25.09,24.03 R18.2
N$33
  Top 0.127: U7.1 30.45,19.05 30.04,18.64 X4.2
N$34
  Top 0.127: X4.1 30.95,19.97 U7.2
N$44
  Top 0.127: T3.B 29.93,39.05 R11.1
N$45
  Top 0.127: R9.2 25.23,40 T3.C
NRESET
  Top 0.127: U5.7 6.27,34.41 15.08,25.59 21.54,25.59 23.54,27.59
  Top 0.2: R1.1 23.54,27.59 23.52,27.61 U$1.24
RFP1
  Top 0.3: L1.2 C9.2 J3.FEED
RST  (via drill 0.2)
  Top 0.127: RESET.2 27.07,2.52 26.08,2.52 C25.1 T2.C 20.12,3.23 19.32,4.04 R15.1 19.07,4.2 19.07,6.25 v19.1,6.28 | v25.75,14.7 25.75,14.45 24.94,13.64 U1.9
  Bottom 0.127: v19.1,6.28 19.1,7.01 19.6,7.51 19.6,10.57 19.32,10.86 19.32,14.72 19.48,14.89 24.35,14.89 24.91,15.45 25,15.45 v25.75,14.7
RTS  (via drill 0.2)
  Top 0.127: R19.1 23.93,4.32 T2.E 22.84,4.17 v22.65,4.37 | v17.3,7.65 16.1,7.65 15.9,7.85 14.8,7.85 14.51,7.56 U2.24
  Bottom 0.127: v22.65,4.37 22.58,4.37 22.3,4.65 19.3,4.65 17.45,6.5 17.45,7.5 v17.3,7.65
RX  (via drill 0.2)
  Top 0.127: U$1.10 17.56,29.96 v17.4,29.8 17.02,30.18 12.18,30.18 6.42,35.93 U5.4 | U1.16 22.66,15.64 22.66,16.99 23.72,18.05 v24,18.05
  Bottom 0.127: v24,18.05 24,21.35 17.3,28.05 17.3,29.7 v17.4,29.8
RXD
  Top 0.127: U2.26 13.51,7.81 14.2,8.5 18.01,8.5 18.2,8.31 18.61,8.31 18.84,8.55 20.1,8.55 20.59,9.04 20.59,9.67 U1.40
SCK/CLK  (via drill 0.2)
  Top 0.127: U1.31 17.26,12.44 v16.9,12.8 | v20.55,20.9 22.45,20.9 U4.6
  Bottom 0.127: v16.9,12.8 16.9,17.4 19.36,19.86 19.86,19.86 20.14,20.14 20.14,20.64 20.4,20.9 v20.55,20.9
SCL  (via drill 0.2)
  Top 0.127: U1.35 18.64,10.87 17.84,10.87 v17.79,10.91 | v27.38,24.65 27.38,25.5 R3.1 U3.6 28.9,25.6 29.29,25.21 30.46,25.21 31.95,23.73 U7.7
  Bottom 0.127: v17.79,10.91 18.05,11.17 18.05,15.33 18.87,16.16 23.61,16.16 23.75,16.3 23.76,16.3 24.17,16.71 24.17,17.52 24.49,17.85 24.49,18.25 24.25,18.49 24.25,22.75 25.43,23.93 26.02,23.93 26.74,24.65 v27.38,24.65
SCS/CMD  (via drill 0.2)
  Top 0.127: U1.30 17.56,12.84 17.11,13.29 16.61,13.29 v15.7,14.2 | v14,23.3 14.27,23.57 U4.1
  Bottom 0.127: v15.7,14.2 15.7,21.75 14.15,23.3 v14,23.3
SDA  (via drill 0.2)
  Top 0.127: U7.6 32.45,24.67 U3.1 31.61,25.5 R2.1 33.12,26.4 v33.08,26.45 | U1.38 19.81,9.29 19.6,9.08 19.05,9.08 v18.59,9.54
  Bottom 0.127: v18.59,9.54 18.5,9.54 18.5,9.9 18.5,10.57 18.55,10.62 18.55,15.12 19.08,15.65 24.03,15.65 24.68,16.3 24.68,17.31 25,17.64 25,18.46 24.76,18.7 24.76,20.44 25.27,20.95 25.27,21.68 24.66,22.3 24.66,22.79 25.54,23.68 26.13,23.68 26.6,24.15 30.15,24.15 32.45,26.45 v33.08,26.45
SDI/SD1  (via drill 0.2)
  Top 0.127: U1.33 16.86,11.64 v15.85,12.65 | v18.05,19.35 18.45,19.75 18.77,19.75 19.16,20.14 19.16,20.55 19.45,20.84 19.86,20.84 20.94,19.75 U4.5
  Bottom 0.127: v15.85,12.65 15.85,13.65 16.19,13.99 16.19,14.4 15.95,14.64 15.95,17.25 v18.05,19.35
SDO/SD0
  Top 0.127: U4.2 14.7,22.3 13.77,21.37 13.77,15.73 15.21,14.29 15.21,13.99 16.41,12.8 16.41,12.6 16.96,12.04 U1.32
SHD/SD2
  Top 0.127: U4.7 19.2,22.3 17.89,20.99 17.2,20.99 16.45,20.25 16.45,19.55 16.45,14.51 16.45,14.17 16.82,13.8 17.32,13.8 17.48,13.64 U1.28
SWDCLK
  Top 0.127: U5.8 6.28,33.92 14.86,25.34 23.29,25.34 25.1,27.15 25.1,28.38 U$1.25
SWDIO
  Top 0.127: U5.9 6.26,33.42 14.59,25.08 23.43,25.08 25.45,27.1 25.45,28.71 24.61,29.55 U$1.26
SWO
  Top 0.127: U5.6 6.21,34.92 15.28,25.85 20.08,25.85 22.31,28.07 U$1.21
SWP/SD3
  Top 0.127: U4.3 14.97,21.02 14.2,20.25 14.2,15.9 15.41,14.69 15.9,14.69 16.19,14.4 16.19,14.07 16.71,13.55 17.21,13.55 17.52,13.24 U1.29
TFTDC  (via drill 0.2)
  Top 0.127: U1.27 17.44,14.04 17.42,14.06 16.92,14.06 16.7,14.28 16.7,19.8 v17.4,20.5 | v15.45,37.45 15.9,37.9 16.55,37.9 16.71,38.06 17.28,38.06 17.75,38.53 U$2.7
  Bottom 0.127: v17.4,20.5 18.15,21.25 18.15,22.02 9.7,30.47 9.7,34.8 12.35,37.45 v15.45,37.45
TFTRESET  (via drill 0.2)
  Top 0.127: U1.25 17.61,14.84 17.3,15.15 17.3,19.34 18.26,20.3 v18.5,20.3 | U$2.6 18.55,38.1 18.26,37.81 17.16,37.81 16.75,37.4 v16.7,37.4
  Bottom 0.127: v18.5,20.3 18.5,22.3 10.4,30.4 10.4,34.82 12.54,36.96 15.65,36.96 16.1,37.4 v16.7,37.4
TX  (via drill 0.2)
  Top 0.127: U1.14 23.41,16.66 v23.5,16.75 | U$1.8 v17.31,30.76 v17.3,30.75 17,30.45 12.4,30.45 6.43,36.41 U5.3
  Bottom 0.127: v23.5,16.75 23.5,21.2 16.85,27.85 16.85,30.45 17.15,30.75 v17.3,30.75
TXD
  Top 0.127: U2.25 14.01,7.71 14.54,8.24 17.91,8.24 18.09,8.06 18.71,8.06 18.94,8.29 20.42,8.29 21,8.87 21,9.16 21.02,9.17 U1.41
VDD  (via drill 0.2, 0.3)
  Top 0.127: U1.46 23.01,10.07 23.23,10.3 24.42,10.3 24.48,10.37 U1.1 | U2.6 10.21,3.63 v10.15,3.57
  Top 0.2: U1.19 21.41,16.61 C6.2 21.36,16.74 22.14,17.53 v22.14,17.64 | C28.1 27.45,26.48 R3.2 | R3.2 27.62,26.6 U3.5 | U1.37 19.01,10.09 17.84,10.09 C24.2 17.02,10.02 16.89,10.02 16.16,10.75 v15.9,10.75 | U$1.13 19.12,27.52 C22.2 19.05,27.45 v19.8,27.45 | U$1.48 18.33,35.15 C33.1 18.33,34.42 v18.35,34.4 | U$1.36 24.32,34.83 C11.1 23.05,35.4 v22.85,35.2 | R15.2 17.65,4.45 v17.65,4.9 | U7.10 30.45,23.66 v30.4,23.7 | R2.2 33.12,23.93 v33.1,23.9 | R3.2 27.48,27.27 v27.45,27.3 | R1.2 24.43,27.18 v24,26.75 | U5.2 6.98,36.92 v7,36.9 | U1.46 v23.01,8.86 v23,8.85 | U1.43 21.8,9.25 21.75,9.19 v21.75,8.85 | R10.1 5.25,14.95 S1.2 | U1.3 U1.4 24.59,11.64 24.6,11.65 25.65,11.65 25.71,11.71 C7.2 26.25,12.3 v26.4,12.3 | C14.2 v24.8,1.35 | C26.1 24.48,9.84 24.48,10.37 | 14.55,38.65 U$2.11
  Top 0.3: C29.1 21.41,36.92 21.41,37.05 20.15,38.31 U$2.4 v20.15,40.75 | C27.1 14.25,37.86 14.55,38.16 14.55,38.65 | v15.35,40.8 U$2.10 U$2.11
  Route15 0.127: v24.8,1.35 19.65,1.35 17.85,3.15 17.85,3.2
  Route15 0.2: v26.4,12.3 26.35,12.3 23.5,15.15
  pour Route15: 0,0 15.4,0 23.9,8.5 23.9,14.6 24.7,15.4 26.7,17.4 33.9,17.4 33.9,28.3 24.3,28.3 23.9,28.7 23.7,28.9 23.7,32.6 23.7,34.5 28.2,39 33.9,39 33.9,41.9 0,41.9
VDD_SDIO
  Top 0.127: U1.26 17.16,14.44 16.96,14.64 16.96,19.36 17.89,20.3 17.89,20.45 18.23,20.79 18.8,20.79 19.75,21.75 23.3,21.75 23.75,22.2 23.75,22.8 22.98,23.57 U4.8
  Top 0.2: U4.8 23.89,23.57 C21.1 24.73,23 R18.1

### Text on the board
tPlace: TFT | MESH | RX | MEM | CPU0 | CPU1 | INTR | CMS | PWR